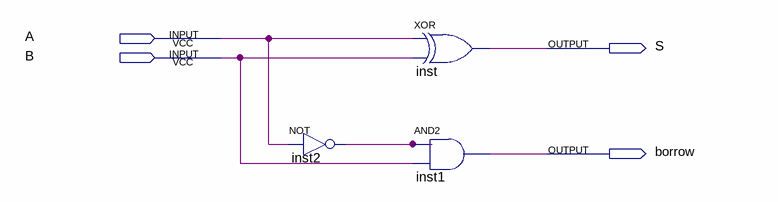
[diagram p0: schematic sheet]
// Quartus schematic bfs_hs.bdf as structural Verilog: 3 symbols, 4 pins
module bfs_hs (
  input  A,
  input  B,
  output S,
  output borrow
);

  wire inst2_out;

  not inst2 (inst2_out, A);
  xor inst (S, A, B);
  and inst1 (borrow, inst2_out, B);
endmodule
